# EAGLE design habexpico (EAGLE 6.5.0)
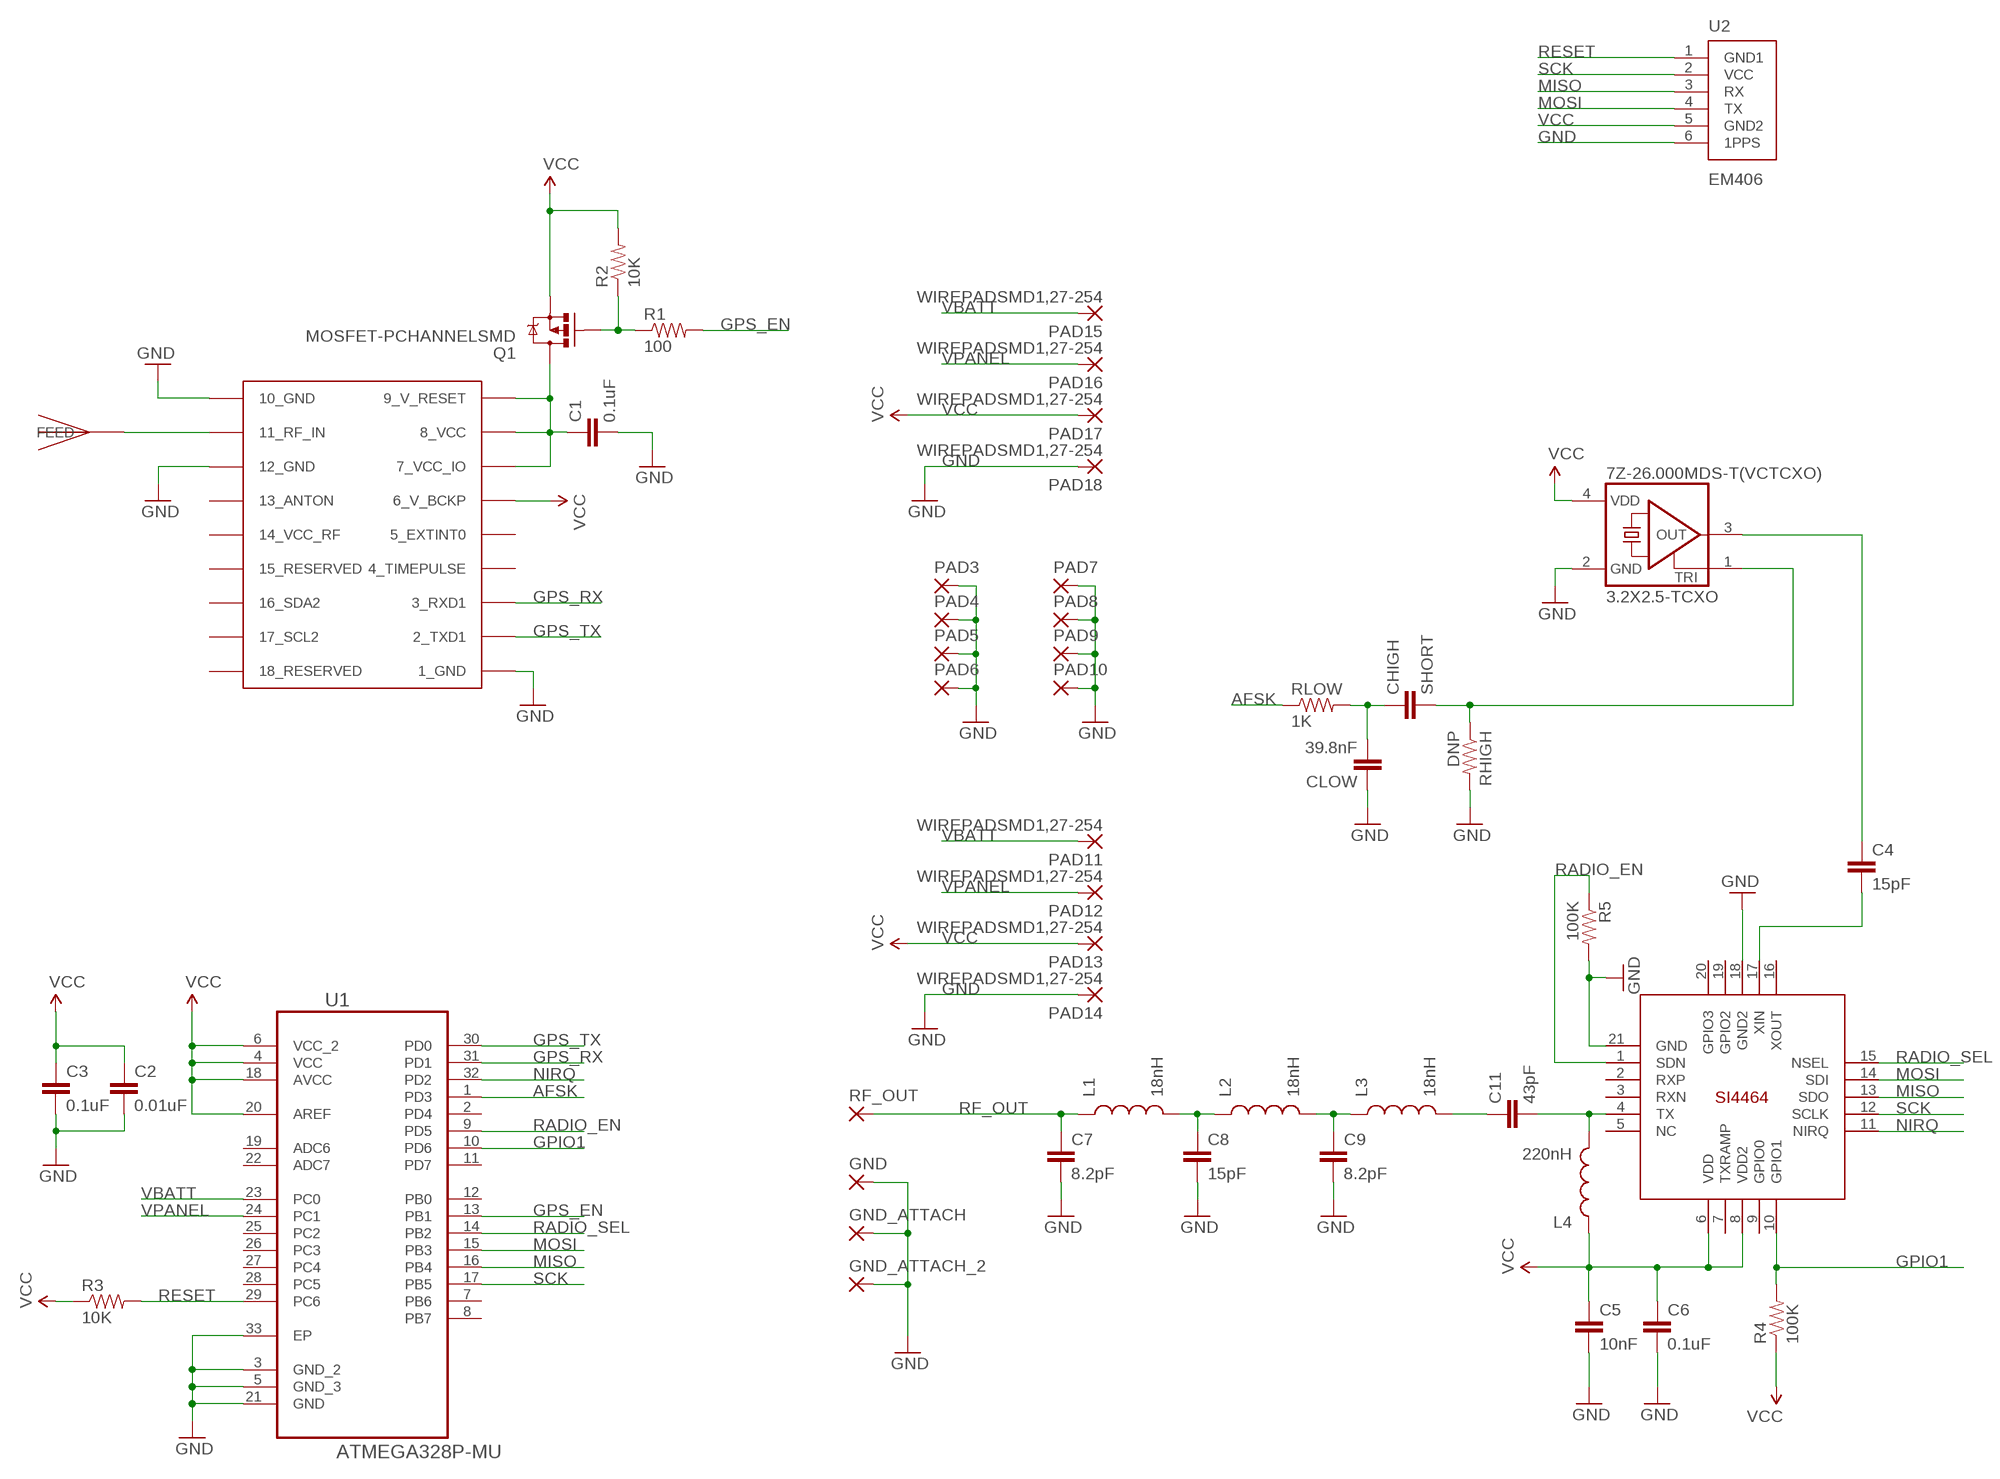
[diagram p0: schematic, sheet 1, part 1 of 2]
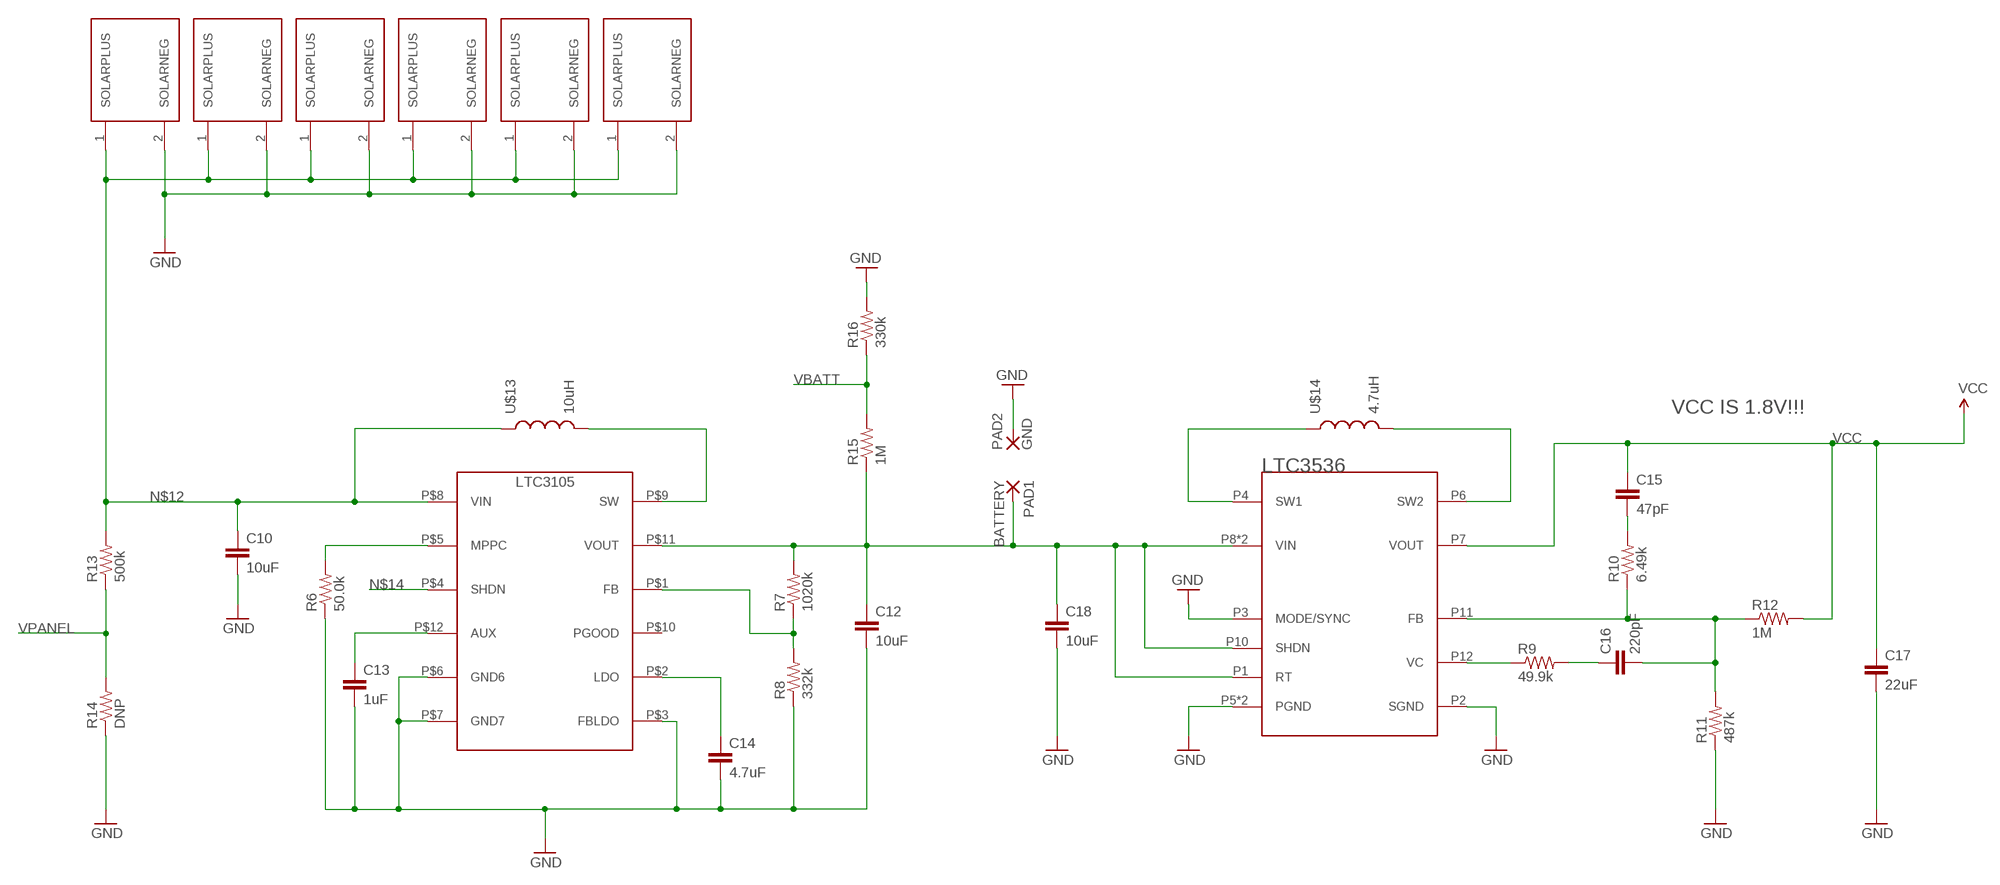
[diagram p1: schematic, sheet 1, part 2 of 2]

## Parts
7Z-26.000MDS-T(VCTCXO)  3.2X2.5-TCXO  [3.2X2.5-TCXO]
C1  0.1uF  CAP0603-CAP  [0603-CAP]
C2  0.01uF  CAP0603-CAP  [0603-CAP]
C3  0.1uF  CAP0603-CAP  [0603-CAP]
C4  15pF  CAP0603-CAP  [0603-CAP]
C5  10nF  CAP0603-CAP  [0603-CAP]
C6  0.1uF  CAP0603-CAP  [0603-CAP]
C7  8.2pF  CAP0603-CAP  [0603-CAP]
C8  15pF  CAP0603-CAP  [0603-CAP]
C9  8.2pF  CAP0603-CAP  [0603-CAP]
C10  10uF  CAP0805  [0805]
C11  43pF  CAP0603-CAP  [0603-CAP]
C12  10uF  CAP0805  [0805]
C13  1uF  CAP0603-CAP  [0603-CAP]
C14  4.7uF  CAP0603-CAP  [0603-CAP]
C15  47pF  CAP0603-CAP  [0603-CAP]
C16  220pF  CAP0603-CAP  [0603-CAP]
C17  22uF  CAP0603-CAP  [0603-CAP]
C18  10uF  CAP0805  [0805]
CHIGH  SHORT  CAP0603-CAP  [0603-CAP]
CLOW  39.8nF  CAP0603-CAP  [0603-CAP]
GND  SMD5  [SMD2,54-5,08]
GND_ATTACH  SMD2  [SMD1,27-2,54]
GND_ATTACH_2  SMD2  [SMD1,27-2,54]
L1  18nH  INDUCTOR0603  [0603]
L2  18nH  INDUCTOR0603  [0603]
L3  18nH  INDUCTOR0603  [0603]
L4  220nH  INDUCTOR0603  [0603]
PAD1  BATTERY  WIREPADSMD5-2,5  [5-2,5]
PAD2  GND  WIREPADSMD5-2,5  [5-2,5]
PAD3  SMD2  [SMD1,27-2,54]
PAD4  SMD2  [SMD1,27-2,54]
PAD5  SMD2  [SMD1,27-2,54]
PAD6  SMD2  [SMD1,27-2,54]
PAD7  SMD2  [SMD1,27-2,54]
PAD8  SMD2  [SMD1,27-2,54]
PAD9  SMD2  [SMD1,27-2,54]
PAD10  SMD2  [SMD1,27-2,54]
PAD11  WIREPADSMD1,27-254  [SMD1,27-2,54]
PAD12  WIREPADSMD1,27-254  [SMD1,27-2,54]
PAD13  WIREPADSMD1,27-254  [SMD1,27-2,54]
PAD14  WIREPADSMD1,27-254  [SMD1,27-2,54]
PAD15  WIREPADSMD1,27-254  [SMD1,27-2,54]
PAD16  WIREPADSMD1,27-254  [SMD1,27-2,54]
PAD17  WIREPADSMD1,27-254  [SMD1,27-2,54]
PAD18  WIREPADSMD1,27-254  [SMD1,27-2,54]
Q1  MOSFET-PCHANNELSMD  [SOT23-3]
R1  100  RESISTOR0603-RES  [0603-RES]
R2  10K  RESISTOR0603-RES  [0603-RES]
R3  10K  RESISTOR0603-RES  [0603-RES]
R4  100K  RESISTOR0603-RES  [0603-RES]
R5  100K  RESISTOR0603-RES  [0603-RES]
R6  50.0k  RESISTOR0603-RES  [0603-RES]
R7  1020k  RESISTOR0603-RES  [0603-RES]
R8  332k  RESISTOR0603-RES  [0603-RES]
R9  49.9k  RESISTOR0603-RES  [0603-RES]
R10  6.49k  RESISTOR0603-RES  [0603-RES]
R11  487k  RESISTOR0603-RES  [0603-RES]
R12  1M  RESISTOR0603-RES  [0603-RES]
R13  500k  RESISTOR0603-RES  [0603-RES]
R14  DNP  RESISTOR0603-RES  [0603-RES]
R15  1M  RESISTOR0603-RES  [0603-RES]
R16  330k  RESISTOR0603-RES  [0603-RES]
RF_OUT  SMD5  [SMD2,54-5,08]
RHIGH  DNP  RESISTOR0603-RES  [0603-RES]
RLOW  1K  RESISTOR0603-RES  [0603-RES]
U1  ATMEGA328P-MU  [QFN50P500X500X100-33N]
U2  EM406  [EM406]
U$1  SI4464  [QFN20+GNDPAD]
U$2  UBLOX_MAX  [UBLOX_MAX]
U$4  JTI_ANTENNA-1575AT43A40  [JTI_ANTENNA-1575AT43A40]
U$5  LTC3105  [LTC3105]
U$6  LTC3536  [LTC3536-MSE]
U$7  KXOB22-12X1  [KXOB22-12X1]
U$8  KXOB22-12X1  [KXOB22-12X1]
U$9  KXOB22-12X1  [KXOB22-12X1]
U$10  KXOB22-12X1  [KXOB22-12X1]
U$11  KXOB22-12X1  [KXOB22-12X1]
U$12  KXOB22-12X1  [KXOB22-12X1]
U$13  10uH  COILCRAFT-MSS5131  [COILCRAFT_MSS5131]
U$14  4.7uH  COILCRAFT-MSS5131  [COILCRAFT_MSS5131]

## Nets
AFSK: RLOW.1 U1.1(PD3)
GND: 7Z-26.000MDS-T(VCTCXO).2(GND) C1.2 C2.2 C3.2 C5.2 C6.2 C7.2 C8.2 C9.2 C10.2 C12.2 C13.2 C14.2 C17.2 C18.2 CLOW.1 GND.1(P) GND_ATTACH.1(P) GND_ATTACH_2.1(P) PAD2.1(P) PAD3.1(P) PAD4.1(P) PAD5.1(P) PAD6.1(P) PAD7.1(P) PAD8.1(P) PAD9.1(P) PAD10.1(P) PAD14.1(P) PAD18.1(P) R5.2 R6.1 R8.1 R11.1 R14.1 R16.2 RHIGH.2 U1.3(GND_2) U1.5(GND_3) U1.21(GND) U1.33(EP) U2.6(1PPS) U$1.18(GND2) U$1.21(GND) U$2.1_GND U$2.10_GND U$2.12_GND U$5.P$3(FBLDO) U$5.P$6(GND6) U$5.P$7(GND7) U$6.P2(SGND) U$6.P3(MODE/SYNC) U$6.P5(PGND) U$6.P13(PGND) U$7.2(SOLARNEG) U$8.2(SOLARNEG) U$9.2(SOLARNEG) U$10.2(SOLARNEG) U$11.2(SOLARNEG) U$12.2(SOLARNEG)
GPIO1: R4.2 U1.10(PD6) U$1.10(GPIO1)
GPS_EN: R1.2 U1.13(PB1)
GPS_RX: U1.31(PD1) U$2.3_RXD1
GPS_TX: U1.30(PD0) U$2.2_TXD1
MISO: U1.16(PB4) U2.3(RX) U$1.13(SDO)
MOSI: U1.15(PB3) U2.4(TX) U$1.14(SDI)
N$1: U$2.11_RF_IN U$4.FEED
N$2: C1.1 Q1.3(D) U$2.7_VCC_IO U$2.8_VCC U$2.9_V_RESET
N$3: Q1.1(G) R1.1 R2.1
N$4: C11.2 L4.2 U$1.4(TX)
N$5: C11.1 L3.2
N$6: 7Z-26.000MDS-T(VCTCXO).3(OUT) C4.1
N$7: C4.2 U$1.17(XIN)
N$8: C9.1 L2.2 L3.1
N$9: C8.1 L1.2 L2.1
N$11: R6.2 U$5.P$5(MPPC)
N$12: C10.1 R13.2 U$5.P$8(VIN) U$7.1(SOLARPLUS) U$8.1(SOLARPLUS) U$9.1(SOLARPLUS) U$10.1(SOLARPLUS) U$11.1(SOLARPLUS) U$12.1(SOLARPLUS) U$13.P$2
N$13: U$5.P$9(SW) U$13.P$1
N$14: U$5.P$4(SHDN)
N$15: C13.1 U$5.P$12(AUX)
N$17: C14.1 U$5.P$2(LDO)
N$18: CHIGH.1 CLOW.2 RLOW.2
N$19: R7.1 R8.2 U$5.P$1(FB)
N$20: C12.1 C18.1 PAD1.1(P) R7.2 R15.1 U$5.P$11(VOUT) U$6.P1(RT) U$6.P8(VIN) U$6.P9(VIN) U$6.P10(SHDN)
N$22: 7Z-26.000MDS-T(VCTCXO).1(TRI) CHIGH.2 RHIGH.1
N$23: U$6.P4(SW1) U$14.P$2
N$24: U$6.P6(SW2) U$14.P$1
N$26: C15.2 R10.2
N$27: C16.2 R10.1 R11.2 R12.1 U$6.P11(FB)
N$28: C16.1 R9.2
N$29: R9.1 U$6.P12(VC)
NIRQ: U1.32(PD2) U$1.11(NIRQ)
RADIO_EN: R5.1 U1.9(PD5) U$1.1(SDN)
RADIO_SEL: U1.14(PB2) U$1.15(NSEL)
RESET: R3.2 U1.29(PC6) U2.1(GND1)
RF_OUT: C7.1 L1.1 RF_OUT.1(P)
SCK: U1.17(PB5) U2.2(VCC) U$1.12(SCLK)
VBATT: PAD11.1(P) PAD15.1(P) R15.2 R16.1 U1.23(PC0)
VCC: 7Z-26.000MDS-T(VCTCXO).4(VDD) C2.1 C3.1 C5.1 C6.1 C15.1 C17.1 L4.1 PAD13.1(P) PAD17.1(P) Q1.2(S) R2.2 R3.1 R4.1 R12.2 U1.4(VCC) U1.6(VCC_2) U1.18(AVCC) U1.20(AREF) U2.5(GND2) U$1.6(VDD) U$1.8(VDD2) U$2.6_V_BCKP U$6.P7(VOUT)
VPANEL: PAD12.1(P) PAD16.1(P) R13.1 R14.2 U1.24(PC1)
Unconnected: U1.2(PD4) U1.7(PB6) U1.8(PB7) U1.11(PD7) U1.12(PB0) U1.19(ADC6) U1.22(ADC7) U1.25(PC2) U1.26(PC3) U1.27(PC4) U1.28(PC5) U$1.2(RXP) U$1.3(RXN) U$1.5(NC ) U$1.7(TXRAMP) U$1.9(GPIO0) U$1.16(XOUT) U$1.19(GPIO2) U$1.20(GPIO3) U$2.4_TIMEPULSE U$2.5_EXTINT0 U$2.13_ANTON U$2.14_VCC_RF U$2.15_RESERVED U$2.16_SDA2 U$2.17_SCL2 U$2.18_RESERVED U$5.P$10(PGOOD)

## Notes on the sheet
- VCC IS 1.8V!!!

## Library data of the parts
7Z-26.000MDS-T(VCTCXO) = Ava:3.2X2.5-TCXO
C1-C18 CHIGH CLOW = SparkFun-Capacitors:CAP: Capacitor Standard 0603 ceramic capacitor, and 0.1" leaded capacitor.
GND RF_OUT = wirepad:SMD5: SMD PAD
GND_ATTACH GND_ATTACH_2 PAD3-PAD10 = wirepad:SMD2: SMD PAD
L1-L4 = SparkFun-Passives:INDUCTOR: Inductors Basic Inductor/Choke - 0603 and 1206. Footprints are not proven and vary greatly between part numbers. SRN6045- 33uH, 20% 1.4A SDR0403-560KL - 56uH, 10%, 500mA RMS/740mA peak
PAD1 PAD2 PAD11-PAD18 = wirepad:WIREPAD: Wire PAD connect wire on PCB
Q1 = SparkFun-DiscreteSemi:MOSFET-PCHANNEL: Generic PMOSFET
R1-R16 RHIGH RLOW = SparkFun-Resistors:RESISTOR: Resistor Basic schematic elements and footprints for 0603, 1206, and PTH resistors.
U1 = Ava:ATMEGA328P-MU: Programmable Flash; MPN: ATMEGA328P-MU; OC_FARNELL: 1748522; OC_NEWARK: 26R2526; PACKAGE: QFN-32; SUPPLIER: Atmel
U2 = SparkFun-Connectors:EM406: EM406 GPS Connector Proven layout and schematic for EM406 connector. Spark Fun Electronics SKU : GPS-00579
U$1 = Ava:SI4464
U$2 = Ava:UBLOX_MAX: UBLOX MAX
U$4 = Ava:JTI_ANTENNA-1575AT43A40
U$5 = arko:LTC3105
U$6 = cubex:LTC3536
U$7-U$12 = arko:KXOB22-12X1
U$13 U$14 = Ava:COILCRAFT-MSS5131

## Board
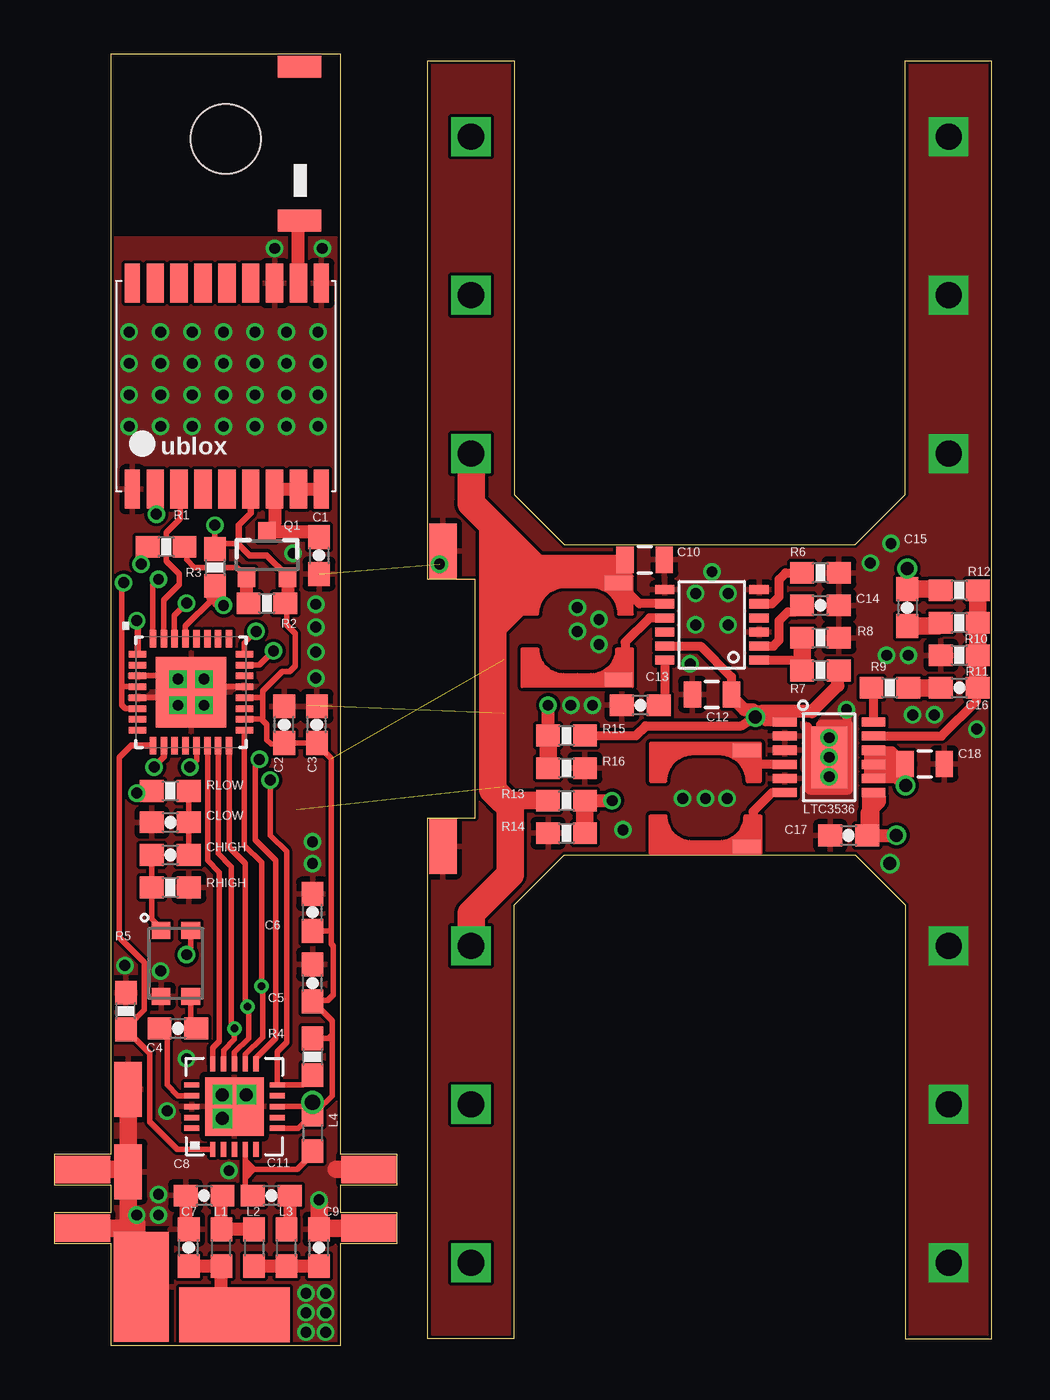
[diagram p2: board, top side]
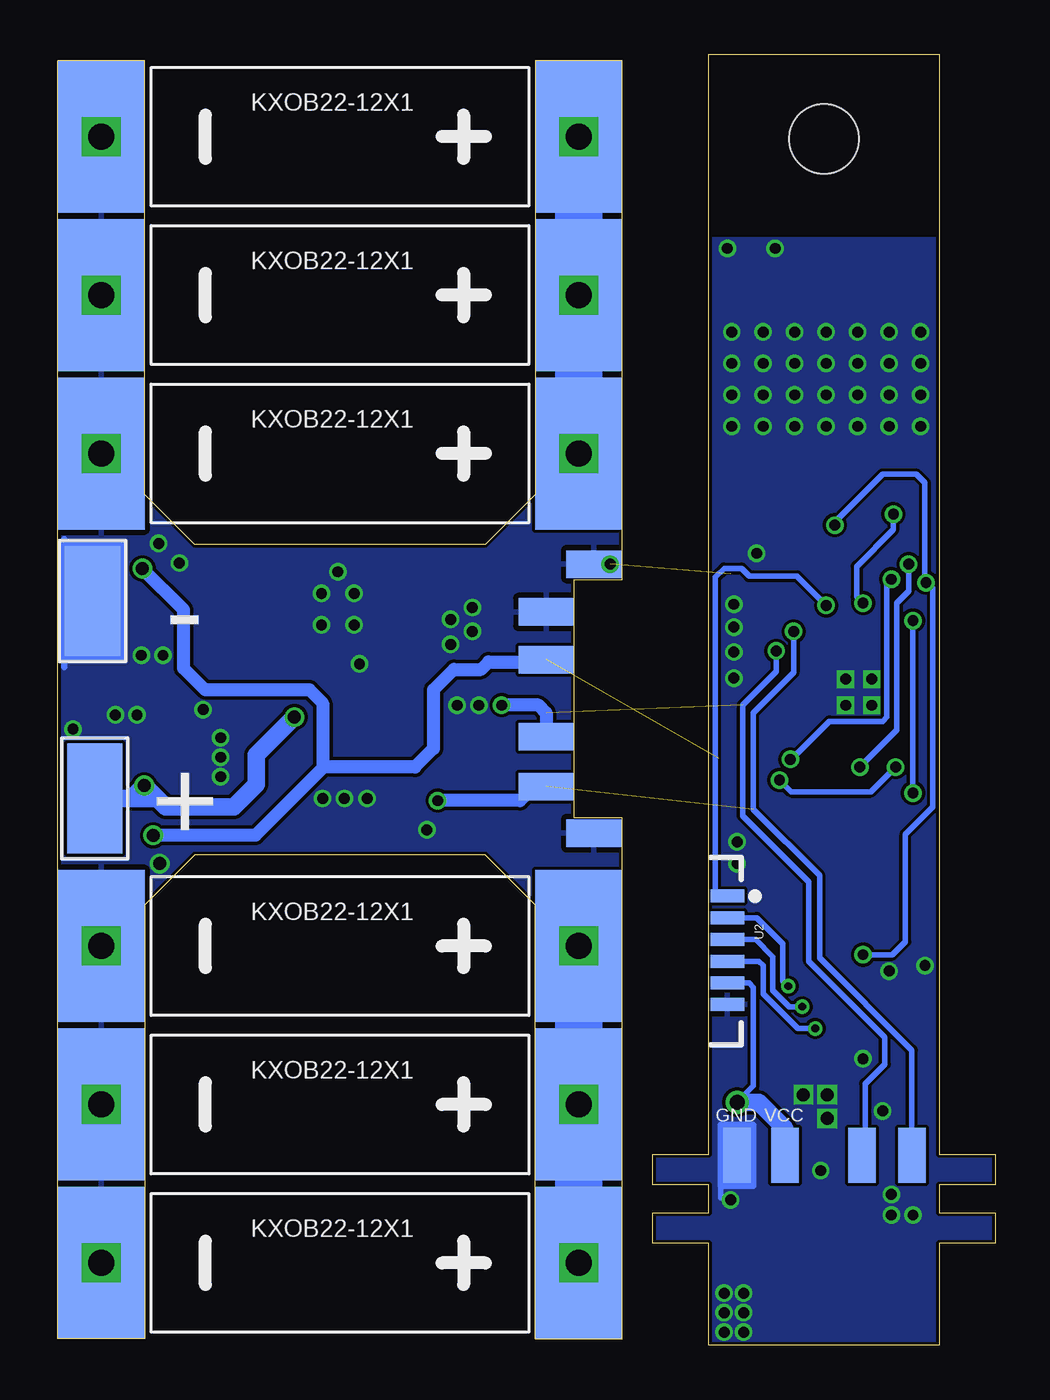
[diagram p3: board, bottom side, seen from below]

Size 43.2 x 59.5 mm. Coordinates in mm from the lower left corner, seen from the top.
Outline: 2.6,0 13.2,0 13.2,4.7 15.8,4.7 15.8,6.1 13.2,6.1 13.2,7.4 15.8,7.4 15.8,8.8 13.2,8.8 13.2,59.5 2.6,59.5 2.6,8.8 0,8.8 0,7.4 2.6,7.4 2.6,6.1 0,6.1 0,4.7 2.6,4.7 2.6,0
Outline: 17.2,59.2 21.2,59.2 21.2,39.2 23.5,36.9 36.9,36.9 39.2,39.2 39.2,59.2 43.2,59.2 43.2,0.3 39.2,0.3 39.2,20.3 36.9,22.6 23.5,22.6 21.2,20.3 21.2,0.3 17.2,0.3 17.2,24.3 19.4,24.3 19.4,35.3 17.2,35.3 17.2,59.2
Copper layers (1*16): Top 0.035mm / dielectric 1.5mm / Bottom 0.035mm
Design rules "hackvana": minimum track width 6mil, minimum drill 0.3mm, track to track 6mil, track to pad 6mil, pad to pad 6mil, via to via 6mil, smd to smd 0mil, copper to edge 6mil, drill to drill 6mil, minimum pad ring 10mil, minimum via ring 6mil, stop-mask expansion 2mil, vias tented up to drill 100mil, thermal gap 10mil
Holes 3.2 mm at 7.9,55.6

### Footprints (pad centres in the part's own frame; a part is rotated, then mirrored left to right if it is on the bottom)
3.2X2.5-TCXO = smd 0.78 x 0.87: 1 -1.515,-0.68; 2 1.515,-0.68; 3 1.515,0.68; 4 -1.515,0.68
0603-CAP = smd 1.1 x 1: 1 -0.85,0; 2 0.85,0
0805 = smd 0.8 x 1.2: 1 -0.9,0; 2 0.9,0
SMD2,54-5,08 = smd 2.54 x 5.08: 1 0,0
SMD1,27-2,54 = smd 1.27 x 2.54: 1 0,0
0603 = smd 1.1 x 1: 1 -0.85,0; 2 0.85,0
5-2,5 = smd 2.54 x 5.08: 1 0,0
SOT23-3 = smd 0.8 x 0.9: 1 -0.95,-1; 2 0.95,-1; 3 0,1.1
0603-RES = smd 1.1 x 1: 1 -0.85,0; 2 0.85,0
QFN50P500X500X100-33N = smd 0.813 x 0.305: 1 -2.464,1.753; 2 -2.464,1.245; 3 -2.464,0.762; 4 -2.464,0.254; 5 -2.464,-0.254; 6 -2.464,-0.762; 7 -2.464,-1.245; 8 -2.464,-1.753; 17 2.464,-1.753; 18 2.464,-1.245; 19 2.464,-0.762; 20 2.464,-0.254; 21 2.464,0.254; 22 2.464,0.762; 23 2.464,1.245; 24 2.464,1.753 | smd 0.305 x 0.813: 9 -1.753,-2.464; 10 -1.245,-2.464; 11 -0.762,-2.464; 12 -0.254,-2.464; 13 0.254,-2.464; 14 0.762,-2.464; 15 1.245,-2.464; 16 1.753,-2.464; 25 1.753,2.464; 26 1.245,2.464; 27 0.762,2.464; 28 0.254,2.464; 29 -0.254,2.464; 30 -0.762,2.464; 31 -1.245,2.464; 32 -1.753,2.464 | smd 3.251 x 3.251: 33 0,0
EM406 = smd 0.6 x 1.55: 1 0,0; 2 1,0; 3 2,0; 4 3,0; 5 4,0; 6 5,0
QFN20+GNDPAD = smd 0.7 x 0.25: 1 -1.97,1; 2 -1.97,0.5; 3 -1.97,0; 4 -1.97,-0.5; 5 -1.97,-1; 11 1.97,-1; 12 1.97,-0.5; 13 1.97,0; 14 1.97,0.5; 15 1.97,1 | smd 0.25 x 0.7: 6 -1,-1.97; 7 -0.5,-1.97; 8 0,-1.97; 9 0.5,-1.97; 10 1,-1.97; 16 1,1.97; 17 0.5,1.97; 18 0,1.97; 19 -0.5,1.97; 20 -1,1.97 | smd 2.7 x 2.7: 21 0,0
UBLOX_MAX = smd 1.8 x 0.7: 1_GND 4.95,-4.4; 9_V_RESET 4.95,4.3; 10_GND -4.55,4.3; 18_RESERVED -4.55,-4.4 | smd 1.8 x 0.8: 2_TXD1 4.95,-3.35; 3_RXD1 4.95,-2.25; 4_TIMEPULSE 4.95,-1.15; 5_EXTINT0 4.95,-0.05; 6_V_BCKP 4.95,1.05; 7_VCC_IO 4.95,2.15; 8_VCC 4.95,3.25; 11_RF_IN -4.55,3.25; 12_GND -4.55,2.15; 13_ANTON -4.55,1.05; 14_VCC_RF -4.55,-0.05; 15_RESERVED -4.55,-1.15; 16_SDA2 -4.55,-2.25; 17_SCL2 -4.55,-3.35
JTI_ANTENNA-1575AT43A40 = smd 1 x 2: FEED -3.175,0; NC 3.925,0
LTC3105 = smd 0.42 x 0.889: P$1 -1.625,-2.171; P$2 -0.975,-2.171; P$3 -0.325,-2.171; P$4 0.325,-2.171; P$5 0.975,-2.171; P$6 1.625,-2.171; P$7 1.625,2.171; P$8 0.975,2.171; P$9 0.325,2.171; P$10 -0.325,2.171; P$11 -0.975,2.171; P$12 -1.625,2.171
LTC3536-MSE = smd 0.42 x 1.1: P1 -1.625,-2.045; P2 -0.975,-2.045; P3 -0.325,-2.045; P4 0.325,-2.045; P5 0.975,-2.045; P6 1.625,-2.045; P7 1.625,2.045; P8 0.975,2.045; P9 0.325,2.045; P10 -0.325,2.045; P11 -0.975,2.045; P12 -1.625,2.045 | smd 2.845 x 1.651: P13 0,0
KXOB22-12X1 = smd 4 x 7: 1 -11,0; 2 11,0
COILCRAFT_MSS5131 = smd 1.27 x 0.635: P$1 -1.905,2.223; P$2 -1.905,-2.223

### Placement (x,y rotation side)
7Z-26.000MDS-T(VCTCXO)  5.6,17.6 270 top
C1  12.2,36.4 270 top
C2  10.6,28.6 90 top
C3  12.1,28.6 90 top
C4  5.7,14.6 180 top
C5  11.9,16.7 90 top
C6  11.9,19.95 90 top
C7  6.2,4.5 90 top
C8  6.9,6.9 180 top
C9  12.2,4.5 90 top
C10  27.2,36.2 0 top
C11  10,6.9 180 top
C12  30.3,30 180 top
C13  27,29.5 180 top
C14  35.3,34.1 0 top
C15  39.3,34 270 top
C16  41.7,30.3 0 top
C17  36.6,23.5 180 top
C18  40.1,26.8 0 top
CHIGH  5.35,22.6 180 top
CLOW  5.35,24.1 0 top
GND  4,2.7 0 top
GND_ATTACH  3.4,11.8 0 top
GND_ATTACH_2  3.4,8 0 top
L1  7.7,4.5 90 top
L2  9.2,4.5 270 top
L3  10.7,4.5 90 top
L4  11.9,9.8 270 top
PAD1  41.5,25.2 0 bottom
PAD2  41.6,34.3 0 bottom
PAD3  1.3,8.1 90 top
PAD4  14.5,8.1 90 top
PAD5  14.5,5.4 90 top
PAD6  1.3,5.4 90 top
PAD7  18.5,23.6 90 bottom
PAD8  18.5,36 90 bottom
PAD9  17.9,36.6 180 top
PAD10  17.9,23 180 top
PAD11  6.15,8.75 180 bottom
PAD12  3.85,8.75 0 bottom
PAD13  9.7,8.75 0 bottom
PAD14  11.9,8.75 0 bottom
PAD15  20.7,28.05 90 bottom
PAD16  20.7,25.75 90 bottom
PAD17  20.7,31.6 90 bottom
PAD18  20.7,33.8 90 bottom
Q1  9.8,36.4 0 top
R1  5.15,36.8 180 top
R2  9.8,34.2 0 top
R3  7.4,35.85 270 top
R4  11.9,13.3 270 top
R5  3.3,15.4 90 top
R6  35.3,35.6 180 top
R7  35.3,31.1 0 top
R8  35.3,32.6 180 top
R9  38.5,30.3 0 top
R10  41.7,33.3 180 top
R11  41.7,31.8 0 top
R12  41.7,34.8 180 top
R13  23.6,25.1 180 top
R14  23.6,23.6 0 top
R15  23.6,28.1 180 top
R16  23.6,26.6 0 top
RF_OUT  8.3,1.4 270 top
RHIGH  5.35,21.1 0 top
RLOW  5.35,25.55 0 top
U1  6.3,30.1 0 top
U2  12.35,20.7 270 bottom
U$1  8.3,11 90 top
U$2  8,44.4 270 top
U$4  11.3,55 90 top
U$5  30.3,33.2 90 top
U$6  35.7,27.1 270 top
U$7  30.2,18.4 180 bottom
U$8  30.2,11.1 180 bottom
U$9  30.2,3.8 180 bottom
U$10  30.2,41.1 180 bottom
U$11  30.2,48.4 180 bottom
U$12  30.2,55.7 180 bottom
U$13  24.1,32.9 180 top
U$14  30,25.2 180 top

### Tracks (layer width: path | path; a pad name or v marks a point on that pad's centre or on a via)
AFSK  (via drill 0.5)
  Top 0.254: RLOW.1 3.95,25.6 v3.8,25.45
  Top 0.305: U1.1 3.84,33.36 v3.8,33.4
  Bottom 0.254: v3.8,25.45 v3.8,33.4
GND  (via drill 0.5, 0.6, 1.2)  (1 unrouted)
  Top 0.254: U1.3 5.54,30.86 v5.7,30.7 U1.33 | U1.5 6.05,29.85 U1.33 | U1.21 6.55,30.35 U1.33
  Top 0.406: 34.7,28.5 34.7,25.7 34.8,25.6 36.6,25.6 36.6,28.6 | 36.6,28.6 35.3,28.6 | v36.5,29.3 36.5,28.7 36.6,28.6
  Top 0.61: C8.2 6.05,5.5 C7.2 | PAD9.1 17.9,36.15 v17.75,36
  Top 0.813: 3.4,4.1 3.4,5.5 | 3.4,5.5 GND_ATTACH_2.1 | GND_ATTACH_2.1 3.4,11.9 | 3.8,5.6 3.8,5.2 | PAD6.1 3.3,5.4 3.4,5.5 | PAD3.1 3.1,8.1 GND_ATTACH_2.1 | PAD5.1 12.3,5.4 | PAD4.1 13,8.1 | v12.2,6.7 12.2,5.4
  Bottom 0.254: 12.65,7.35 12.65,6.8 v12.2,6.7
  Bottom 0.305: 41.65,36.95 40.2,36.95 40.2,31.6 40.25,31.6 40.3,31.65 42.9,31.65 | 42.9,31.65 42.9,31.25 | 42.9,31.65 42.9,36.95 | 42.9,37.15 42.9,36.95 | 42.9,36.95 41.6,36.95 41.55,37 | 11.15,10.15 11.15,7.35 12.65,7.35 12.65,10.15 11.15,10.15
  other vias: 4.9,17.25 5.2,10.8 6.1,13.2 41.2,41.1 41.2,48.4 41.2,55.7 41.2,18.4 41.2,11.1 41.2,3.8 24.1,32.9 23.8,29.5 24.8,29.5 29.3,31.4 35.7,27.1 35.7,28 35.7,26.2 30,25.2 6.9,30.7 6.9,29.5 5.7,29.5 11.6,2.4 12.5,2.4 11.6,1.5 12.5,1.5 11.6,0.6 12.5,0.6 3.8,6 12.05,34.15 8.05,8.05 4.8,6 12.05,30.75 30.3,35.65 11,36.5 7.75,11.55 8.85,11.55 7.75,10.45 11.9,22.2 11.9,23.2 3.25,17.5 12.05,33.1 29.55,34.65 31.05,34.65 29.55,33.2 31.05,33.2 24.1,34 25.1,33.45 25.1,32.3 28.95,25.2 31,25.2 26.2,23.75 38.35,31.8 39.35,31.8 39.55,29.05 40.55,29.05 37.6,36.05 38.55,36.95 4.8,6.95 12.05,31.95 3.45,46.7 4.9,46.7 6.35,46.7 7.8,46.7 9.25,46.7 10.7,46.7 12.15,46.7 3.45,45.25 4.9,45.25 6.35,45.25 7.8,45.25 9.25,45.25 10.7,45.25 12.15,45.25 3.45,43.8 3.45,42.35 4.9,43.8 4.9,42.35 6.35,43.8 6.35,42.35 7.8,42.35 7.8,43.8 9.25,43.8 9.25,42.35 10.7,42.35 10.7,43.8 12.15,43.8 12.15,42.35 10.15,50.55 12.35,50.55 38.5,22.2 42.5,28.4
  pour Top: 2.6,0 13.2,0 13.2,4.7 15.8,4.7 15.8,6.1 13.2,6.1 13.2,7.4 15.8,7.4 15.8,8.8 13.2,8.8 13.2,51.05 2.6,51.05 2.6,8.8 0,8.8 0,7.4 2.6,7.4 2.6,6.1 0,6.1 0,4.7 2.6,4.7
  pour Bottom: 2.6,0 13.2,0 13.2,4.7 15.8,4.7 15.8,6.1 13.2,6.1 13.2,7.4 15.8,7.4 15.8,8.8 13.2,8.8 13.2,51.05 2.6,51.05 2.6,8.8 0,8.8 0,7.4 2.6,7.4 2.6,6.1 0,6.1 0,4.7 2.6,4.7
  pour Bottom: 21.2,0.3 17.2,0.3 17.2,24.3 19.4,24.3 19.4,35.3 17.2,35.3 17.2,59.2 21.2,59.2 21.2,39.2 23.5,36.9 36.9,36.9 39.2,39.2 39.2,59.2 43.2,59.2 43.2,0.3 39.2,0.3 39.2,20.3 36.9,22.6 23.5,22.6 21.2,20.3
  pour Top: 17.2,0.3 17.2,24.3 19.4,24.3 19.4,35.3 17.2,35.3 17.2,59.2 21.2,59.2 21.2,39.2 23.5,36.9 36.9,36.9 39.2,39.2 39.2,59.2 43.2,59.2 43.2,0.3 39.2,0.3 39.2,20.3 36.9,22.6 23.5,22.6 21.2,20.3 21.2,0.3
GPIO1  (via drill 0.5)
  Top 0.254: R4.2 11.45,12 U$1.10 10.27,13.52 10.7,13.95 10.7,22.75 9.95,23.5 v9.95,26.05
  Top 0.305: U1.10 5.05,27.11 v4.6,26.65
  Bottom 0.254: v9.95,26.05 9.4,25.5 5.75,25.5 v4.6,26.65
GPS_EN  (via drill 0.5)
  Top 0.254: U1.13 6.55,26.95 v6.25,26.65 | R1.2 4.25,36.8 4,36.55 v4,36
  Bottom 0.254: v4,36 4,34.75 4.55,34.2 4.55,28.35 v6.25,26.65
GPS_RX
  Top 0.254: U$2.3_RXD1 5.75,38.75 5.8,38.7 5.8,38.1 5.15,37.45 5.15,36.15 5.75,35.55 5.75,35.05 5.05,34.35 U1.31
GPS_TX  (via drill 0.5)
  Top 0.254: U1.30 5.54,33.64 v6.1,34.2 | U$2.2_TXD1 4.65,38.35 v4.7,38.3
  Bottom 0.254: v4.7,38.3 4.7,37.6 6.4,35.9 6.4,34.5 v6.1,34.2
MISO  (via drill 0.36)
  Top 0.254: U$1.13 8.3,13.5 8.95,14.15 8.95,15.55 v8.9,15.6 8.8,15.7 8.8,22.2 8.05,22.95 U1.16
  Bottom 0.254: v8.9,15.6 9.5,15.6 10.25,16.35 10.25,17.9 11.05,18.7 U2.3
MOSI  (via drill 0.36)
  Top 0.254: U$1.14 7.8,13.6 8.3,14.1 v8.3,14.6 8.3,14.65 8.15,14.8 8.15,22.05 7.54,22.66 U1.15
  Bottom 0.254: U2.4 10.9,17.7 10.7,17.5 10.7,16.2 9.1,14.6 v8.3,14.6
N$1
  Top 0.61: U$2.11_RF_IN 11.25,51.77 U$4.FEED
N$2
  Top 0.61: U$2.9_V_RESET U$2.8_VCC U$2.7_VCC_IO 10.15,37.85 Q1.3 11.95,37.5 C1.1
N$3
  Top 0.254: Q1.1 8.4,35.85 6.45,35.85 6.1,36.2 6.1,36.7 R1.1
  Top 0.61: Q1.1 8.85,34.3 R2.1
N$4
  Top 0.254: U$1.4 8.8,8.5 | 8.8,8.5 8.8,8 | 8.8,8 8.8,7.7 | 8.8,7.7 8.8,7.25 C11.2 | L4.2 12.05,8.95 11.2,8.1 9.2,8.1 | 9.2,8.1 8.9,8.1 8.8,8 | 9.2,8.1 8.8,8.5 | 9.2,8.1 8.8,7.7
N$5
  Top 0.61: C11.1 10.85,5.5 L3.2
N$6
  Top 0.254: 7Z-26.000MDS-T(VCTCXO).3 6.28,14.87 C4.1
N$7
  Top 0.254: U$1.17 5.7,11.5 5.2,12 5.2,14.25 C4.2
N$8
  Top 0.61: C9.1 L3.1 L2.2
N$9
  Top 0.61: L2.1 L1.2 7.7,6.85 C8.1
N$11
  Top 0.406: U$5.P$5 33.08,34.17 33.4,34.5 33.4,35.3 33.7,35.6 R6.2
N$12  (via drill 1.2)
  Top 0.406: U$5.P$8 26.95,34.17 U$13.P$2 26.3,35.42 C10.1
  Top 0.813: R13.2 20.7,25.1 20.45,25.35
  Top 1.27: 20.3,37.3 20.4,37.3 21.3,36.4 21.3,34.2 20.2,33.1 | U$10.1 19.2,38.8 20.2,37.8 | U$7.1 19.2,19.9 21,21.7 21,24.8 20.45,25.35 20.2,25.6 20.2,33.1 | 20.2,33.1 20.2,37.8 | U$13.P$2 26.01,35.7 25.9,35.8 22.2,35.8 20.2,37.8
  Bottom 2.184: U$12.1 U$11.1 U$10.1 | U$7.1 U$8.1 U$9.1
  other vias: 19.2,41.1 19.2,48.4 19.2,55.7 19.2,18.4 19.2,11.1 19.2,3.8
N$13
  Top 0.406: U$5.P$9 27.43,33.52 26.3,32.4 26.3,30.97 U$13.P$1
N$15
  Top 0.406: U$5.P$12 28.13,29.78 C13.1
N$17
  Top 0.406: U$5.P$2 33.12,32.23 33.4,32.5 33.4,33.4 33.8,33.8 34.15,33.8 C14.1
N$18
  Top 0.254: RLOW.2 CLOW.2 CHIGH.1
N$19
  Top 0.406: U$5.P$1 33.98,31.57 R7.1
  Top 0.813: R7.1 R8.2
N$20  (via drill 0.6)
  Top 0.406: 33.17,28.73 U$6.P1 32.77,28.73 v32.3,28.95 31.65,28.55 27.25,28.55 26.8,28.1 R15.1 | C18.1 38.8,27.2 37.9,27.2 37.75,27.36 U$6.P10 U$6.P9 U$6.P8 38.8,26.12 | C18.1 38.8,26.8 38.2,26.2 38,26.4 38,26.8 | 38,26.9 38,27.3 38.1,27.4 | C18.1 38.6,27.4 38.2,27.4 37.9,27.1 37.9,26.9 38,26.8 | 38,26.8 38,26.9 | 38,26.9 37.5,27.4 37.5,26.3 37.6,26.2 | 38.8,26.12 38.89,26.12 | 38.5,26.4 38.8,26.4 38.8,26.12 | U$5.P$11 29.78,32.23 31.2,30.8 C12.1
  Top 0.61: 36.2,31.05 R7.2 36.1,31.05 36.1,30.4 34.9,29.2 32.55,29.2 v32.3,28.95 32.2,29.3 31.8,29.3 31.2,29.9 C12.1 | v39.22,25.8 38.89,26.12
  Top 0.813: C18.1 38,26.8 37.77,26.8 U$6.P9 | 32.45,29.1 v32.3,28.95
  Bottom 0.813: 38.7,25.2 PAD1.1 39.82,25.2 v39.22,25.8 38.22,24.8 35.1,24.8 34.05,25.85 34.05,27.2 v32.3,28.95
N$22
  Top 0.254: CHIGH.2 RHIGH.1 4.5,19.65 4.92,19.23 7Z-26.000MDS-T(VCTCXO).1
N$23
  Top 0.406: U$6.P4 32.55,26.77 U$14.P$2
N$24
  Top 0.406: U$6.P6 33.08,25.48 32.2,24.6 32.2,23.27 U$14.P$1
N$26
  Top 0.813: C15.2 40.7,33.15 R10.2
N$27
  Top 0.406: U$6.P11 40.88,28.07 42.5,29.7 42.5,30.25 C16.2
  Top 0.813: R12.1 R10.1 R11.2 C16.2
N$28
  Top 0.813: C16.1 R9.2
N$29
  Top 0.406: U$6.P12 37.75,30.21 R9.1
NIRQ  (via drill 0.5)
  Top 0.254: U1.32 4.55,35.05 v4.8,35.3 | U$1.11 9.3,13.25 10.2,14.15 10.2,22.35 9.25,23.3 9.25,26.8 v9.45,27
  Bottom 0.254: v9.45,27 9.4,27 7.65,28.75 5.2,28.75 5,28.95 5,35.1 v4.8,35.3
RADIO_EN
  Top 0.254: U$1.1 5.67,9.03 4.4,10.3 4.4,13.45 R5.1 3.2,14.75 3.45,14.75 4.15,15.45 4.15,17.65 3,18.8 3,27.1 3.54,27.64
  Top 0.305: U1.9 3.54,27.64
RADIO_SEL
  Top 0.254: U$1.15 7.3,13.7 7.6,14 7.6,21.8 7.06,22.34 U1.14
RESET  (via drill 0.5)
  Top 0.254: U1.29 6.05,33.15 7.3,34.4 7.3,34.5 7.3,34.9 R3.2
  Top 0.61: v7.8,34.1 7.7,34.1 7.3,34.5
  Bottom 0.254: U2.1 12.85,20.7 12.9,20.75 12.9,35.4 12.5,35.8 11.7,35.8 11.35,35.45 9.15,35.45 v7.8,34.1
RF_OUT
  Top 0.61: C7.1 L1.1 7.7,1.6 7.8,1.5 RF_OUT.1
SCK  (via drill 0.36)
  Top 0.254: U$1.12 8.8,13.4 9.6,14.2 9.6,16.5 v9.55,16.55 9.55,22.25 8.76,23.04 U1.17
  Bottom 0.254: U2.2 11,19.7 9.8,18.5 9.8,16.8 v9.55,16.55
VBATT  (via drill 0.5)  (1 unrouted)
  Top 0.254: U1.23 9.45,31.34 v10.1,32
  Top 0.61: R15.2 v22.75,29.5
  Top 0.813: R15.2 R16.1
  Bottom 0.254: v10.1,32 10.1,31.05 11.65,29.5 11.65,24.4 8.6,21.35 8.6,17.7 5.1,14.2 5.1,12.95 6,12.05 6,8.9 PAD11.1
  Bottom 0.61: v22.75,29.5 21.05,29.5 20.7,29.15 PAD15.1
VCC  (via drill 0.5, 0.6, 0.7)  (1 unrouted)
  Top 0.254: 11.75,11 L4.1 | L4.1 12.1,10.7 12.1,10.8 12.8,11.5 12.8,14.3 | 12.8,14.3 12.8,14.95 C5.1 11.95,15.9 12.6,15.9 12.85,16.15 12.85,18.4 12.75,18.5 12.75,19 | 12.8,14.3 12.65,14.15 R4.1 | U$1.6 11.25,10 L4.1 | U$1.8 11.55,11 L4.1 | U1.18 9.54,28.86 | 9.54,28.86 9.8,28.6 9.8,27.9 10,27.7 10.55,27.7 C2.1 C3.1 12.1,27.7 12.75,27.05 12.75,19 | U1.20 9.55,29.85 9.6,29.8 | 9.6,29.8 9.6,28.91 9.54,28.86 | U1.4 3.15,30.35 3.1,30.3 | U1.6 3.26,29.34 3.1,29.5 3.1,30.3 | 10.85,34.15 10.7,34.15 | 9.6,29.8 9.6,30.15 10.5,31.05 10.85,31.05 11.1,31.3 11.1,32.8 10.7,33.2 10.7,34.15 | 10.7,34.15 R2.2 | 7Z-26.000MDS-T(VCTCXO).4 6.28,18.18 v6.1,18 | v7.4,37.8 R3.1 7.65,36.95 8.5,36.95 | C6.1 12.65,19.1 12.75,19 | v11.9,11.2 L4.1 | 3.1,30.3 3.1,35.1 3.15,35.1 v3.2,35.15
  Top 0.305: Q1.2 10.75,35.45 9.8,36.4 9,36.4 8.5,36.9 8.5,36.95 8.5,37.8 9.05,38.35 U$2.6_V_BCKP | 10.85,34.15 10.7,34
  Top 0.406: 37.7,24.8 37.75,24.84 U$6.P7 37.93,25.48 38.1,25.3 38.1,25 37.8,24.7 | 37.6,24.5 37.6,25.2 37.4,25.4 37.4,24.6 37.5,24.5 37.6,24.5 | 37.6,24.5 37.8,24.7 | 37.8,24.7 37.8,23.7 37.6,23.5
  Top 0.61: Q1.2 10.75,34.3 R2.2 | 37.7,24.8 37.45,24.55 C17.1 37.6,23.5 v38.8,23.5 | C15.1 v39.3,35.8
  Top 0.813: C15.1 40.8,34.85 R12.2
  Bottom 0.254: v6.1,18 4.75,18 4.15,18.6 4.15,23.55 2.9,24.8 2.9,34.9 2.95,34.9 v3.2,35.15 3.25,35.2 3.25,39.75 3.65,40.15 5.2,40.15 7.4,37.95 v7.4,37.8 | U2.5 11.35,16.7 11.15,16.5 11.15,11.95 v11.9,11.2
  Bottom 0.406: PAD13.1 9.7,9.6
  Bottom 0.61: v38.8,23.5 34.1,23.5 31,26.6 | v39.3,35.8 37.4,33.9 37.4,31.2 36.4,30.2 31.6,30.2 31,29.6 31,26.6 | 31,26.6 30.95,26.65 26.75,26.65 25.9,27.5 25.9,30.2 24.95,31.15 23.7,31.15 23.35,31.5 20.8,31.5 PAD17.1
  Bottom 0.813: 9.7,9.6 9.7,10 10.9,11.2 v11.9,11.2
VPANEL  (via drill 0.5)  (1 unrouted)
  Top 0.254: U1.24 8.76,32.36 v9.3,32.9
  Top 0.61: R13.1 v25.7,25.1
  Top 0.813: R13.1 R14.2
  Bottom 0.254: v9.3,32.9 9.3,31 11.15,29.15 11.15,24.7 8.1,21.65 8.1,17.85 3.85,13.6 PAD12.1
  Bottom 0.61: PAD16.1 21.25,25.75 21.9,25.1 v25.7,25.1

### Text on the board
bNames: - | + | VCC | GND